# EAGLE design oresat-camera-card-usb-breakout-v0 (EAGLE 9.4.2)
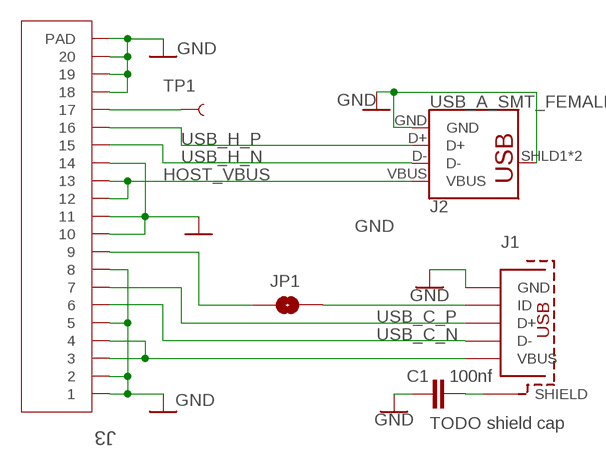
[diagram p0: schematic, sheet 1]

## Parts
C1  100nf  C-EU0603-A  [.0603-A]
J1  MICRO-USB-SOCKET  [629105136821]
J2  USB_A_SMT_FEMALE  [USB-A-S-SILK-FEMALE]
J3  2-1734592-0  [TE_2-1734592-0]
JP1  JUMPER-SMT_2_NO_SILK  [SMT-JUMPER_2_NO_SILK]
TP1  TEST-POINTPOGO_PTH  [1X01_NO_SILK]

## Nets
CLIENT_VBUS: J1.1(VBUS) J3.3 J3.4
GND: C1.1 J1.5(GND) J2.GND J2.SHLD1(SHIELD) J2.SHLD2(SHIELD) J3.1 J3.2 J3.5 J3.8 J3.10 J3.11 J3.14 J3.18 J3.19 J3.20 J3.S1(PAD) J3.S2(PAD)
HOST_VBUS: J2.VBUS J3.12 J3.13
N$1: C1.2 J1.SHELL1(SHIELD) J1.SHELL2(SHIELD) J1.SHELL3(SHIELD) J1.SHELL(SHIELD)
N$2: J3.17 TP1.1
N$3: J1.4(ID) JP1.2
N$5: J3.9 JP1.1
USB_C_N: J1.2(D-) J3.6
USB_C_P: J1.3(D+) J3.7
USB_H_N: J2.D- J3.15
USB_H_P: J2.D+ J3.16

## Notes on the sheet
- TODO shield cap

## Library data of the parts
C1 = oresat-rcl:C-EU: CAPACITOR, European symbol
J1 = J-Wurth-629105136821-Micro-USB-A:MICRO-USB-SOCKET: WR-COM SMT Horizontal 5 Contacts Micro USB Type B,5 pins=>Code : Con_I-O_COM_MicroUSB_629105136821 <http://katalog.we-online.de/media/images/eican/Con_I-O_COM_MicroUSB_629105136821_pf2.jpg> Details see: http://katalog.we-online.de/en/em/COM_MICRO_SMT_TYPE_B_HORIZONTAL/629105136821?m Created 2014-07-09, Karrer Zheng 2014 (C) Würth Elektronik
J2 = SparkFun-Connectors:USB_A: USB-A Connector Male and female variants, as well as PTH and SMT variants SparkFun Products: SparkFun XBee Explorer Dongle <https://www.sparkfun.com/products/11697> PTH Male SparkFun MicroView-USB Programmer <https://www.sparkfun.com/products/12924> SMT Male SparkFun USB Type A Female Breakout <https://www.sparkfun.com/products/12700> SMT Female; PROD_ID: CONN-09520; SF_ID: PRT-09011
J3 = J-TEConnectivity-X-1734592-X:2-1734592-0
JP1 = SparkFun-Jumpers:JUMPER-SMT_2_NO: Normally open jumper This jumper has two pads in close proximity to each other. Apply solder to close the connection. Round pads are easier to solder for beginners, but are a lot larger. SparkFun Product that uses the round pads: SparkFun EL Sequencer <https://www.sparkfun.com/products/12781>
TP1 = SparkFun-Connectors:TEST-POINT: SparkFun Test Points Bare copper test points for troubleshooting or In-Circuit-Testing. These are used by our Production team for verifying production board runs using pogo-pins on test beds. SparkFun Products: SparkFun LSM9DS1 Breakout <https://www.sparkfun.com/products/13284> SparkFun PSOC <https://www.sparkfun.com/products/13714> SparkFun Load Cell Amplifier <https://www.sparkfun.com/products/13879>

## Board
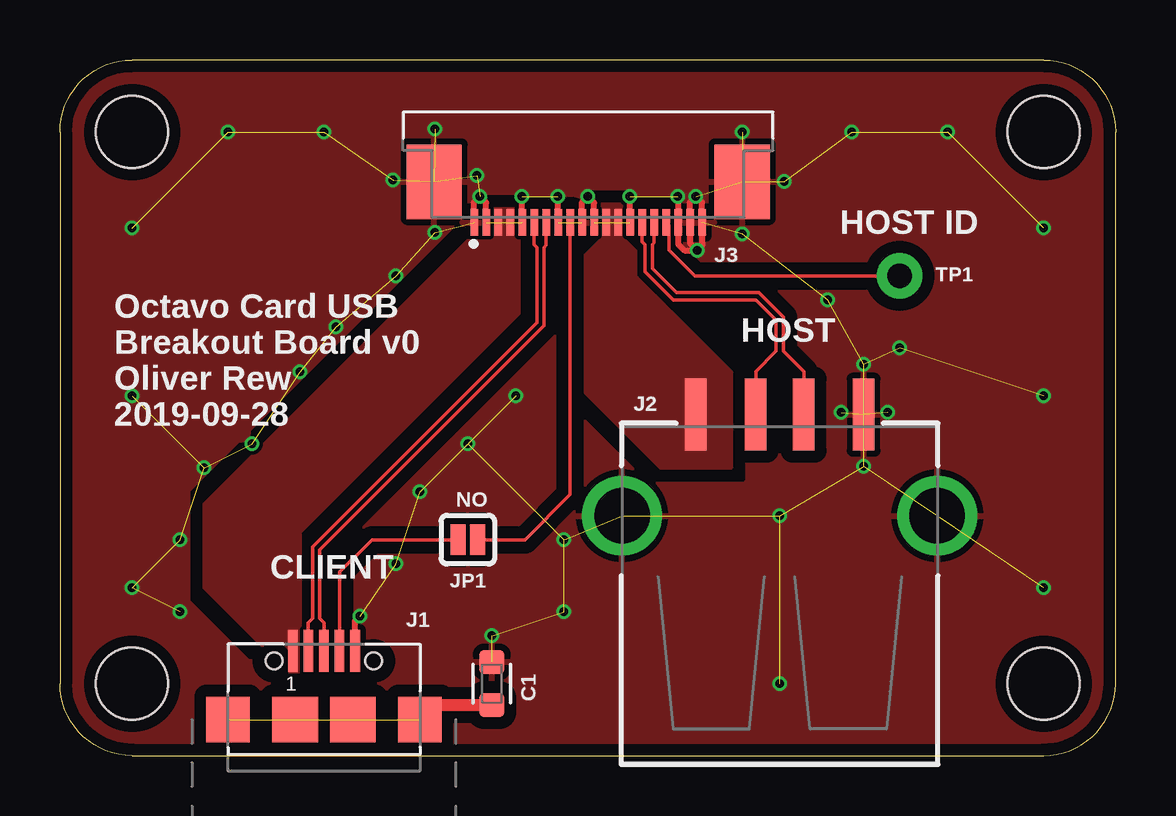
[diagram p1: board, top side]
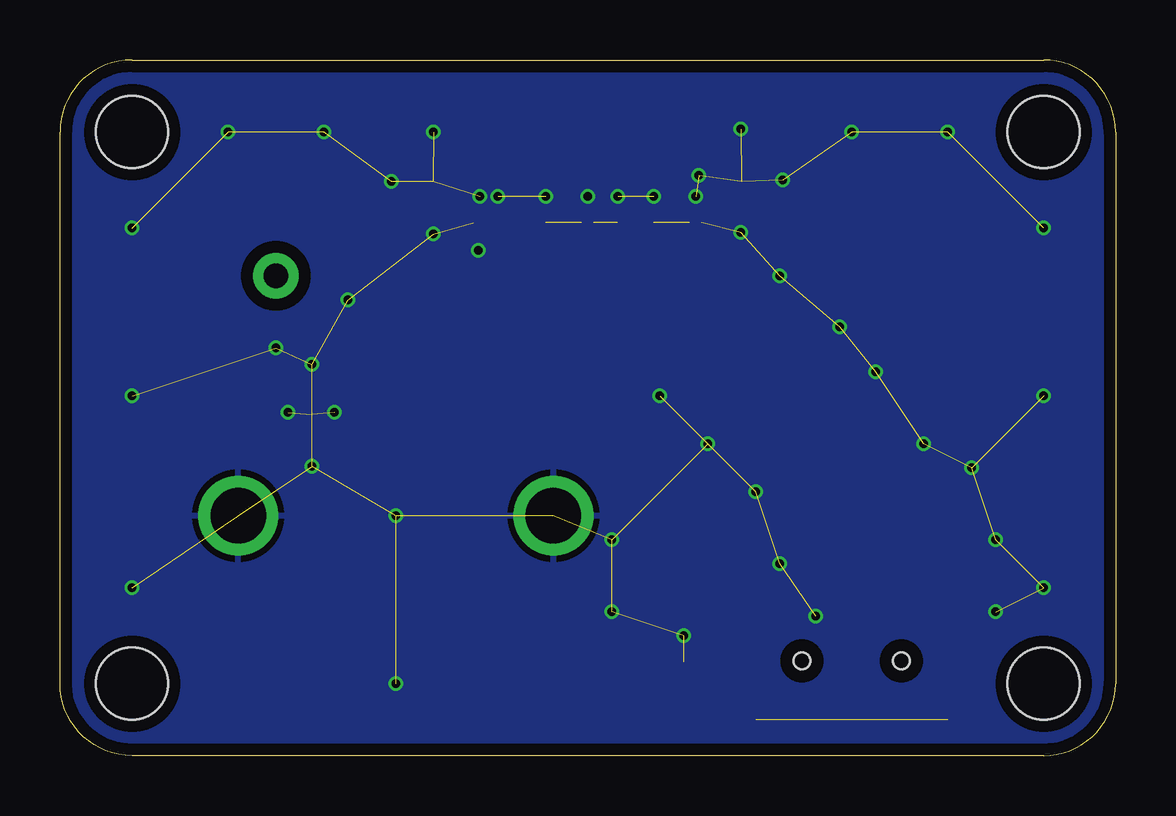
[diagram p2: board, bottom side, seen from below]

Size 44 x 29 mm. Coordinates in mm from the lower left corner, seen from the top.
Outline: 3,0 41,0 arc90 44,3 44,26 arc90 41,29 3,29 arc90 0,26 0,3 arc90 3,0
Copper layers (1*16): Top 0.035559375mm / dielectric 1.6mm / Bottom 0.035559375mm
Design rules "oshpark-2layer *": minimum track width 6mil, minimum drill 10mil, track to track 6mil, track to pad 6mil, pad to pad 6mil, via to via 6mil, smd to smd 6mil, copper to edge 15mil, drill to drill 6mil, minimum pad ring 5mil, minimum via ring 5mil, stop-mask expansion 2.5mil, vias tented up to drill 0.4mm, thermal gap 10mil
Holes 3 mm at 3,26 3,3 41,3 41,26

### Footprints (pad centres in the part's own frame; a part is rotated, then mirrored left to right if it is on the bottom)
.0603-A = smd 1 x 1.05: 1 -0.9,0; 2 0.9,0
629105136821 = smd 0.4 x 1.731: 1 -1.3,2.865; 2 -0.65,2.865; 3 0,2.865; 4 0.65,2.865; 5 1.3,2.865 | smd 1.8 x 1.9: SHELL -4,0; SHELL3 4,0 | smd 1.9 x 1.9: SHELL1 -1.2,0; SHELL2 1.2,0 | hole 0.7: -2.075,2.45; 2.075,2.45
USB-A-S-SILK-FEMALE = smd 3 x 0.9: D+ 7.212,-1; D- 7.212,1; GND 7.212,-3.5; VBUS 7.212,3.5 | drill 2.311: SHLD1 3,-6.566; SHLD2 3,6.566
TE_2-1734592-0 = smd 0.3 x 1.1: 1 -4.75,0; 2 -4.25,0; 3 -3.75,0; 4 -3.25,0; 5 -2.75,0; 6 -2.25,0; 7 -1.75,0; 8 -1.25,0; 9 -0.75,0; 10 -0.25,0; 11 0.25,0; 12 0.75,0; 13 1.25,0; 14 1.75,0; 15 2.25,0; 16 2.75,0; 17 3.25,0; 18 3.75,0; 19 4.25,0; 20 4.75,0 | smd 2.3 x 3.1: S1 6.42,1.7; S2 -6.42,1.7
SMT-JUMPER_2_NO_SILK = smd 0.635 x 1.27: 1 -0.406,0; 2 0.406,0
1X01_NO_SILK = drill 1.016 pad 1.88: 1 0,0

### Placement (x,y rotation side)
C1  18,3 270 top
J1  11,1.5 0 top
J2  30,7 90 top
J3  22.02,22.23 0 top
JP1  17,9 180 top
TP1  35,20 0 top

### Tracks (layer width: path | path; a pad name or v marks a point on that pad's centre or on a via)
CLIENT_VBUS
  pour Top (no thermals): 10,3.5 10,9.31 19.12,18.44 19.12,22.81 18.06,22.81 18.06,22.56 6,10.5 6,7 9.5,3.5
GND  (via drill 0.35)  (51 unrouted)
  Top 0.254: J3.14 23.77,23.31 v23.75,23.31 | J3.11 22.27,23.04 v22,23.31 21.77,23.08 J3.10 | J3.8 20.77,23.29 v20.75,23.31 | J3.5 19.27,23.29 v19.25,23.31 | J3.2 17.77,23.04 v17.5,23.31 17.27,23.08 J3.1 | J1.5 12.3,5.61 v12.5,5.81 | v26.56,21.06 26.27,21.36 J3.19 26.27,23.08 v26.5,23.31 26.77,23.04 J3.20 26.77,21.27 v26.56,21.06 | v25.75,23.31 25.77,23.29 J3.18 25.77,21.33 26.04,21.06 v26.56,21.06
  other vias: 17.38,24.19 15.62,21.81 13.88,24 15.62,26.12 28.44,21.75 30.19,23.94 28.44,26 32.56,14.31 33.5,16.31 34.5,14.31 33.5,12.06 5,6 5,9 6,12 8,13 10,16 11.5,17.88 14,20 14,8 15,11 17,13 19,15 35,17 37,26 41,22 41,7 41,15 33,26 7,26 11,26 3,22 3,7 3,15 18,5 21,6 21,9 32,19 30,10 30,3
  pour Bottom (isolate 0.5): -0.5,-0.5 44.5,-0.5 44.5,29.5 -0.5,29.5
  pour Top (isolate 0.5, rank 2): -1,-1 45,-1 45,30 -1,30
HOST_VBUS
  pour Top (no thermals): 28,12 28,16 24,20 24,21.06 23.5,21.56 23.5,23 22.56,23 22.56,21.56 21.88,20.88 21.88,15.12 25,12
N$1  (3 unrouted)
  Top 0.508: C1.2 15.6,2.1 J1.SHELL3
N$2
  Top 0.152: J3.17 25.39,22.1 25.39,21.08 26.47,20 TP1.1
N$3
  Top 0.152: J1.4 11.65,7.65 13,9 JP1.2
N$5
  Top 0.152: JP1.1 19.38,9 21.27,10.89 J3.9
USB_C_N
  Top 0.152: J1.2 10.35,5.54 10.52,5.71 10.52,8.7 19.88,18.06 19.88,21 19.88,21.19 19.77,21.29 J3.6
USB_C_P
  Top 0.152: J1.3 11,5.54 10.83,5.71 10.83,8.58 20.18,17.93 20.18,21.19 20.27,21.28 J3.7
USB_H_N
  Top 0.152: J2.D- 29,16.02 29.85,16.86 29.85,18.15 29,19 25.57,19 24.38,20.19 24.38,21.31 24.27,21.43 J3.15
USB_H_P
  Top 0.152: J2.D+ 31,16.02 30.15,16.86 30.15,18.28 29.13,19.3 25.7,19.3 24.69,20.31 24.69,21 24.69,21.31 24.77,21.39 J3.16

### Text on the board
tPlace: HOST ID | HOST | Octavo Card USB / Breakout Board v0 / Oliver Rew / 2019-09-28 | NO | CLIENT